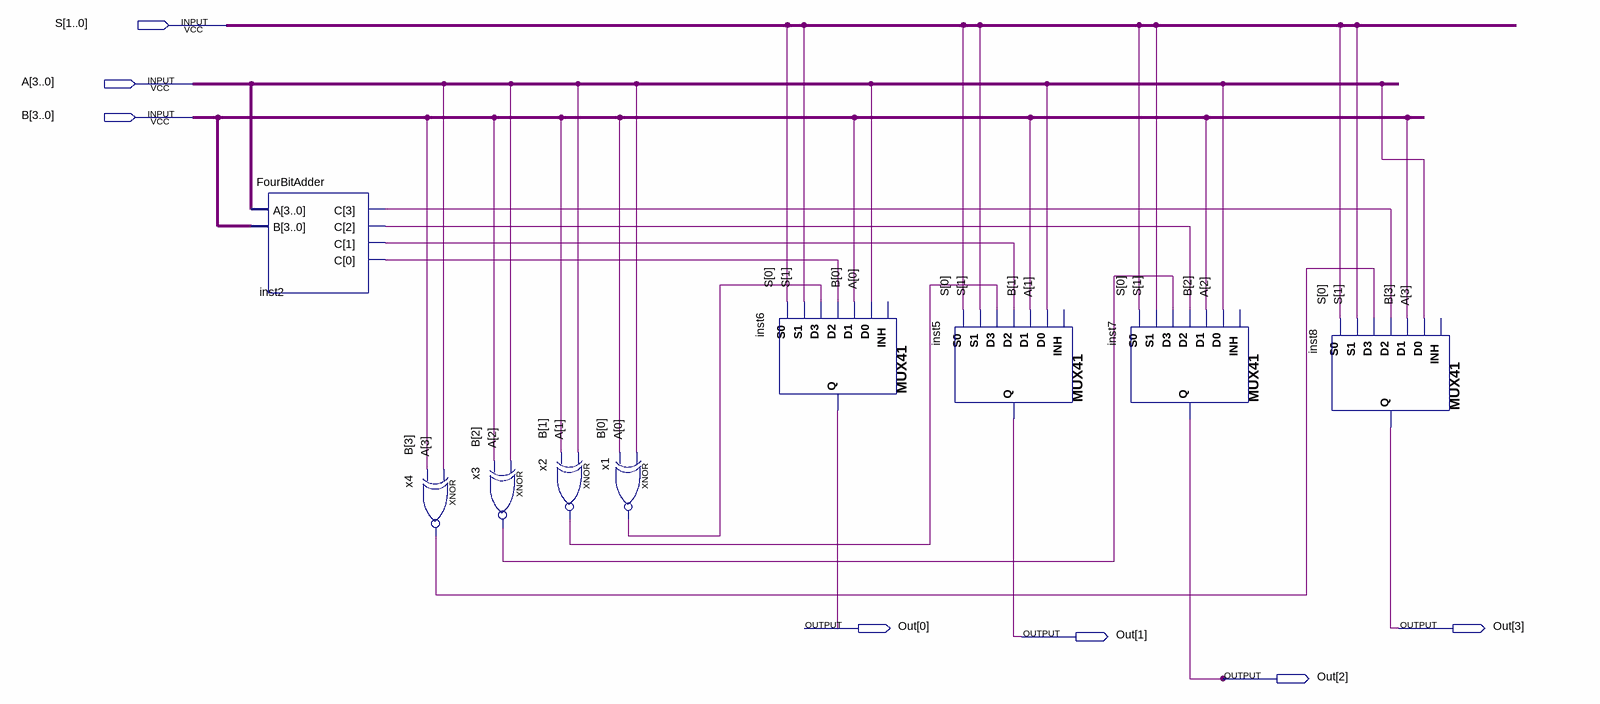
[diagram p0: schematic sheet]
// Quartus schematic MainWeek1.bdf as structural Verilog: 9 symbols, 7 pins
module MainWeek1 (
  input  [1:0] S,
  input  [3:0] A,
  input  [3:0] B,
  output [3:0] Out
);

  wire inst2_c, inst2_c_2, inst2_c_3, inst2_c_4, x1_out, x2_out, x3_out, x4_out;

  FourBitAdder inst2 (.A(A), .B(B), .C({inst2_c, inst2_c_2, inst2_c_3, inst2_c_4}));
  xnor x4 (x4_out, A[3], B[3]);
  xnor x3 (x3_out, A[2], B[2]);
  xnor x2 (x2_out, A[1], B[1]);
  xnor x1 (x1_out, A[0], B[0]);
  MUX41 inst6 (.S0(S[0]), .D2(inst2_c_4), .S1(S[1]), .D3(x1_out), .D0(A[0]), .D1(B[0]), .Q(Out[0]));  // open: INH
  MUX41 inst5 (.S0(S[0]), .D2(inst2_c_3), .S1(S[1]), .D3(x2_out), .D0(A[1]), .D1(B[1]), .Q(Out[1]));  // open: INH
  MUX41 inst7 (.S0(S[0]), .D2(inst2_c_2), .S1(S[1]), .D3(x3_out), .D0(A[2]), .D1(B[2]), .Q(Out[2]));  // open: INH
  MUX41 inst8 (.S0(S[0]), .D2(inst2_c), .S1(S[1]), .D3(x4_out), .D0(A[3]), .D1(B[3]), .Q(Out[3]));  // open: INH
endmodule
